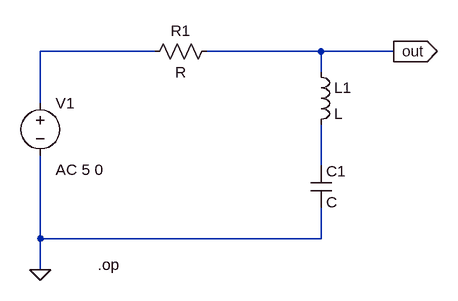
[diagram p0: schematic rlc_series.asc]
rlc_series.asc, the LTspice schematic file:
Version 4
SHEET 1 880 680
WIRE 256 208 80 208
WIRE 512 208 336 208
WIRE 624 208 512 208
WIRE 512 240 512 208
WIRE 80 288 80 208
WIRE 512 384 512 320
WIRE 80 496 80 368
WIRE 512 496 512 448
WIRE 512 496 80 496
WIRE 80 544 80 496
FLAG 80 544 0
FLAG 624 208 out
IOPIN 624 208 Out
SYMBOL voltage 80 272 R0
WINDOW 3 24 96 Invisible 2
WINDOW 123 24 118 Left 2
SYMATTR InstName V1
SYMATTR Value SINE()
SYMATTR Value2 AC 5 0
SYMBOL Res 352 192 R90
WINDOW 0 0 56 VBottom 2
WINDOW 3 32 56 VTop 2
SYMATTR InstName R1
SYMBOL Cap 496 384 R0
SYMATTR InstName C1
SYMBOL ind 496 224 R0
SYMATTR InstName L1
TEXT 168 536 Left 2 !.op

The netlist it stands for:
* rlc_series.asc
V1 N001 0 SINE() AC 5 0
R1 out N001 R
C1 N002 0 C
L1 out N002 L
.op
.backanno
.end